# EasyEDA Pro project TTMT_ENTIRE_EASYEDA_PROJECT.epro, board PCB5
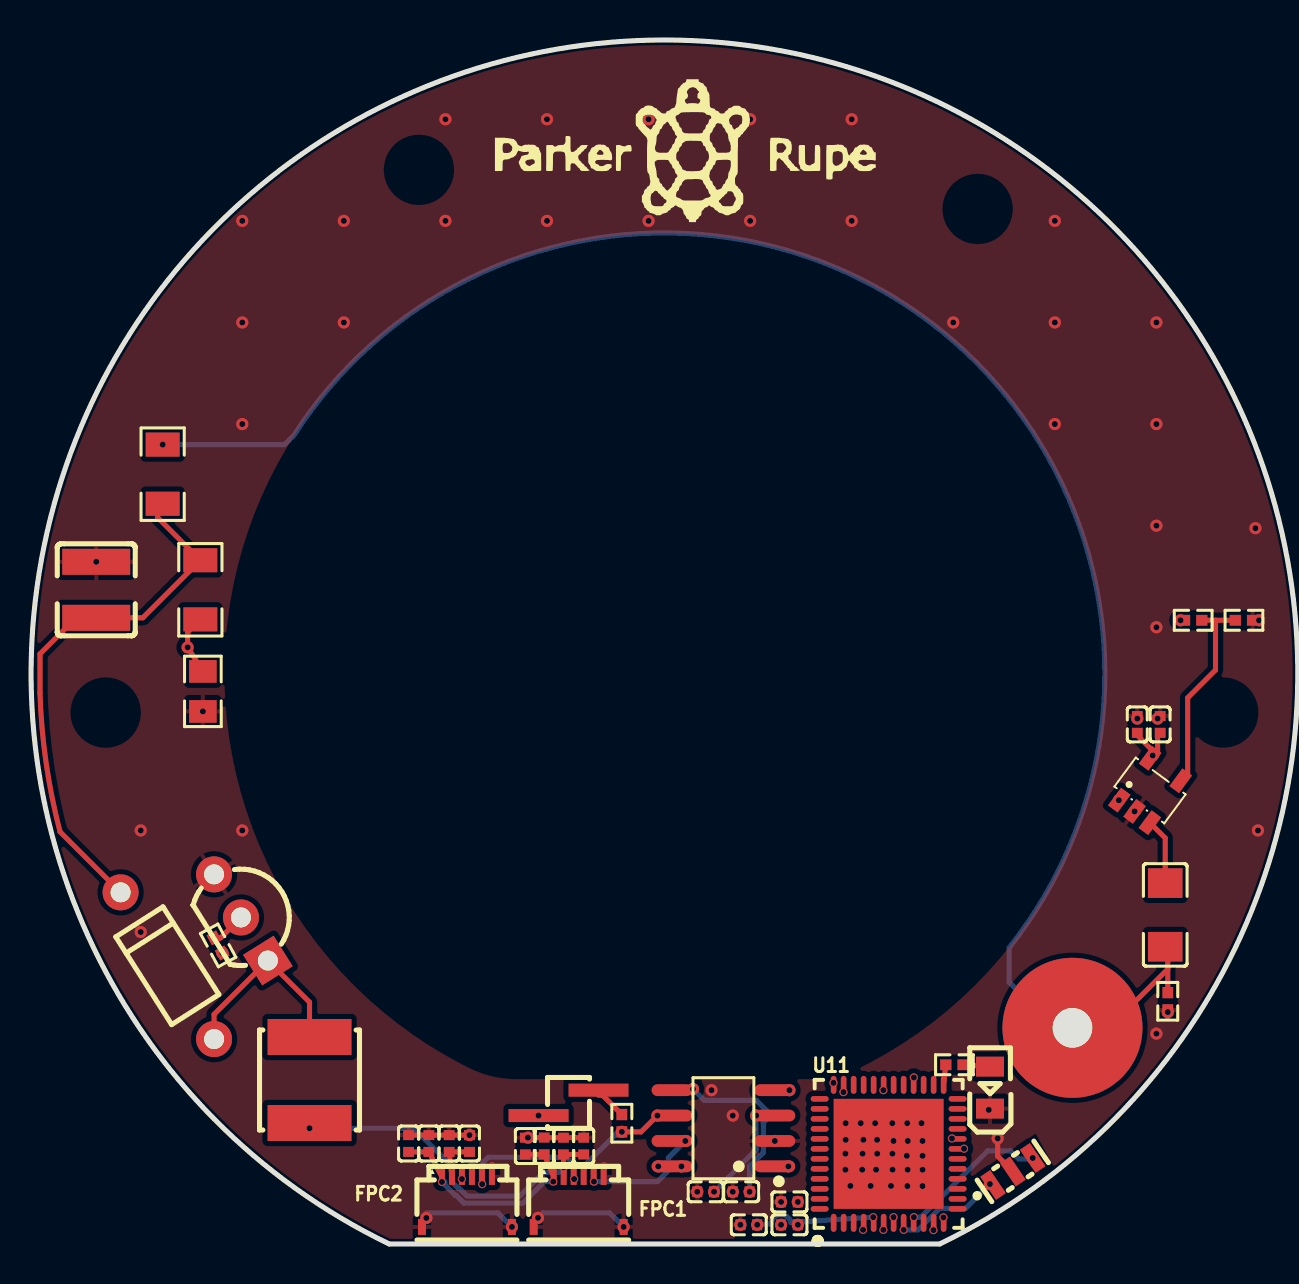
[diagram p16: board, top side]
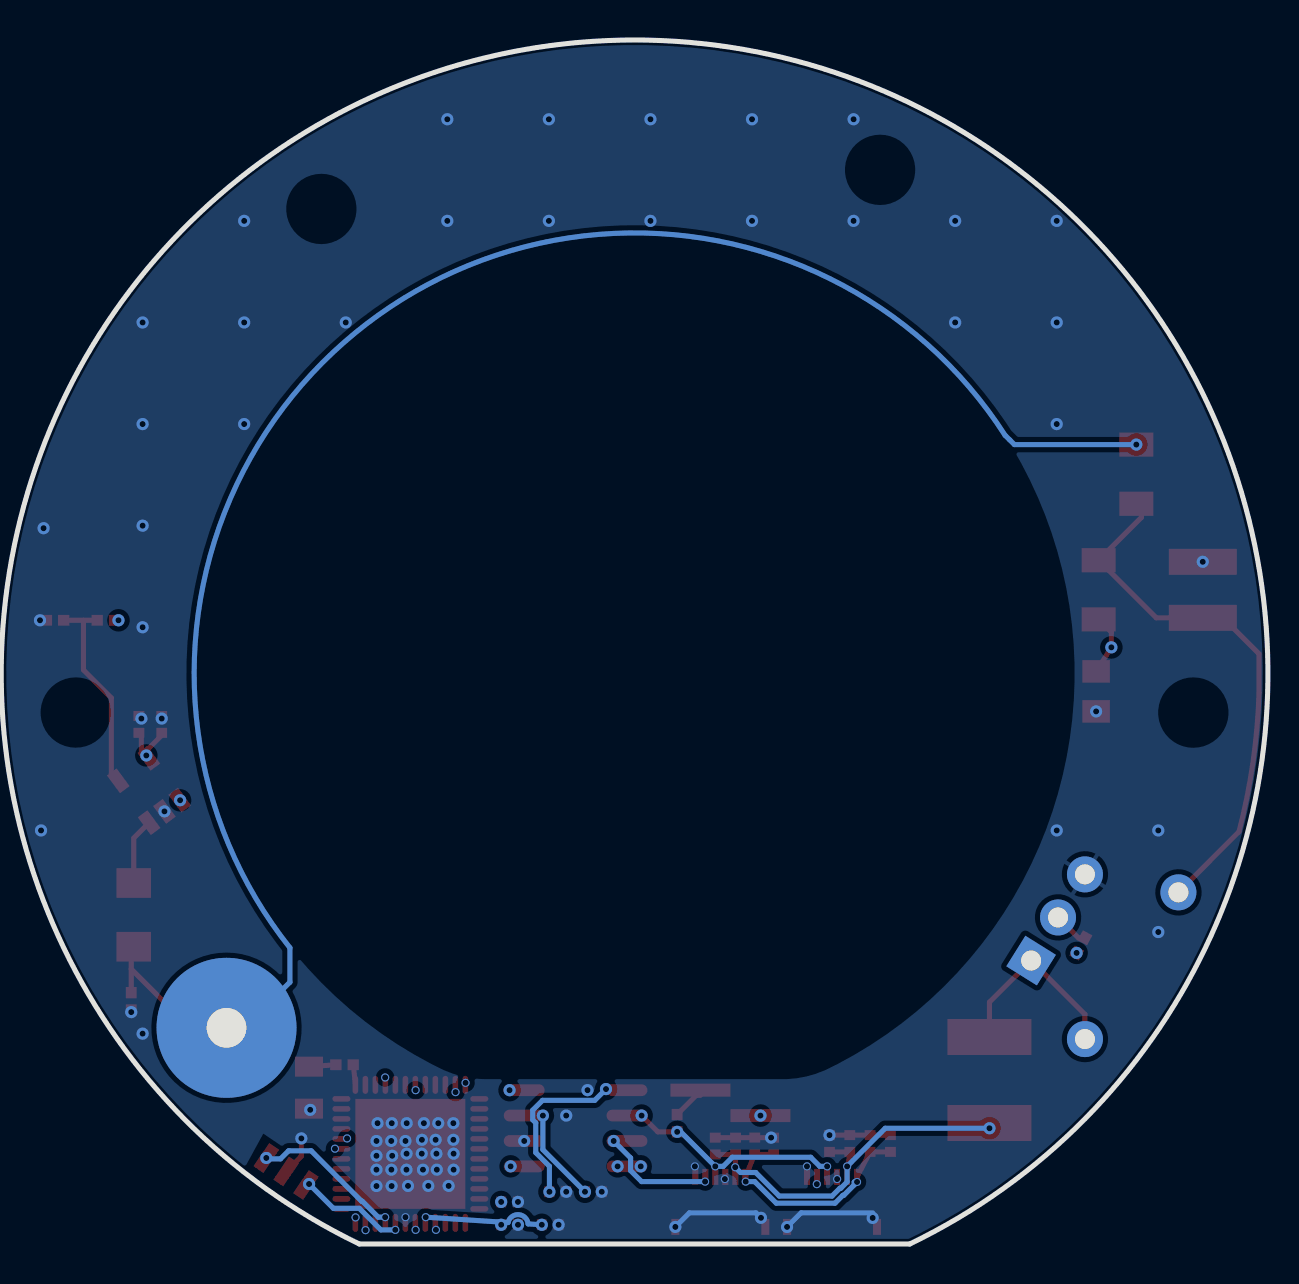
[diagram p17: board, bottom side, seen from below]

Outline 63.35 x 60.2 mm; copper layers: Top Layer, GND, 3V3, Inner3, Inner4, Bottom Layer. Coordinates in mm from the lower left corner of the outline.
Outline path: 17.91,0 45.44,0 arc(31.68,60.2) 17.91,0
Stack: Top Layer 0.035mm Outer layer thickness 1oz / Dielectric1 0.0994mm 3313 RC57% 4.2mil / GND 0.0152mm Inner layer thickness / Dielectric2 0.55mm 0.55mm H/H No copper / 3V3 0.0152mm Inner layer thickness / Dielectric3 0.1088mm 2116 RC54% 4.9mil / Inner3 0.0152mm Inner layer thickness / Dielectric4 0.55mm 0.55mm H/H No copper / Inner4 0.0152mm Inner layer thickness / Dielectric5 0.0994mm 3313 RC57% 4.2mil / Bottom Layer 0.035mm Outer layer thickness 1oz

## Design rules (mm)
template: Custom Config
spacing copperThickness1oz (default): track to track 0.102, other pairs 0 to 0.3
spacing copperThickness2oz: track to track 0.203, other pairs 0 to 0.3
track width copperThickness1oz (default): min 0.127, default 0.254, max 2.54
track width copperThickness2oz: min 0.203, default 0.254, max 2.54
differential pair differentialPair (default): width min 0.127, default 0.254, max 2.54; gap min 0.152, default 0.152
via viaSize (default): diameter min 0.203, default 0.61, max 10; hole min 0.102, default 0.305, max 6.3

## Placement (name value [footprint] x y rotation side)
C1  470pF  [C1111]  3.26 32.71 270 top
C3  100pF  [C1206]  56.72 16.45 90 top
C43  100nF  [C0402]  37.93 0.96 180 top
C44  100nF  [C0402]  37.93 2.1 180 top
C45  100nF  [C0402]  35.9 0.96 180 top
C46  100nF  [C0402]  18.88 5.03 90 top
C47  100nF  [C0402]  21.93 5.03 90 top
C63  10uF  [C0402]  20.91 5.03 270 top
C64  10uF  [C0402]  19.89 5.03 270 top
C65  100nF  [C0402]  24.72 4.9 90 top
C66  10uF  [C0402]  25.66 4.9 270 top
C67  100nF  [C0402]  27.64 4.9 270 top
C68  10uF  [C0402]  26.62 4.9 90 top
C69  100nF  [C0402]  35.51 2.61 180 top
C70  100nF  [C0402]  33.74 2.61 0 top
C71  100nF  [C0402]  55.33 25.98 270 top
C72  10uF  [C0402]  56.47 25.98 270 top
D1  UF4007  [DO-41_BD2.4-L4.7-P8.70-D0.9-RD]  6.81 13.92 302.5 top
FPC1  HC-FPC-05-09-6RLTAG  [FPC-SMD_6P-P0.50_HC-FPC-05-09-6RLTAG]  27.39 2.1 180 top
FPC2  HC-FPC-05-09-6RLTAG  [FPC-SMD_6P-P0.50_HC-FPC-05-09-6RLTAG]  21.8 2.1 180 top
H3  M50-3630242  [HDR-SMD_2P-P1.27_M50-3630242]  26.88 7.06 90 top
L1  1mH  [IND-SMD_L5.0-W5.0_FNR50XXS]  13.92 8.2 90 top
LED4  KT-0805G  [LED0805-R-RD]  47.96 7.82 90 top
Q1  MPSA42  [TO-92-3_L4.8-W3.7-P2.54-R]  10.5 16.33 302 top
R8  1kΩ  [R0402]  46.18 8.96 180 top
R11  560kΩ  [R0402]  58.12 31.19 0 top
R17  10MΩ  [R1206]  8.46 32.71 90 top
R19  120Ω  [R0402]  29.54 6.04 90 top
R20  10kΩ  [R0402]  9.35 14.93 298.4 top
R22  10MΩ  [R1206]  6.58 38.49 90 top
R23  100kΩ  [R0402]  60.66 31.19 0 top
R24  100kΩ  [R0402]  56.85 12.14 90 top
R25  51kΩ  [R0805]  8.59 27.63 90 top
U8  TCAN1042HVDRQ1  [SOIC-8_L4.9-W3.9-P1.27-LS6.0-BL]  34.63 5.79 90 top
U9  TLV3201AIDBVR  [SOT-23-5_L3.0-W1.7-P0.95-LS2.8-BR]  55.96 22.68 233.6 top
U10  SBM-21  [SBM21]  52.08 10.81 0 top
U11  STM32G0B1CEU6  [UFQFPN-48_L7.0-W7.0-P0.50-BL-EP]  42.89 4.51 0 top
X1  8MHz  [OSC-SMD_3P-L3.2-W1.3-P1.20-L]  49.1 3.63 34.2 top

## Footprints (pads in the part's own frame, mm; a bottom-side part is the same pattern mirrored in y, then rotated)
C0402
  rect 0.5x0.54 smd: 1(-0.42,0) 2(0.42,0)
C1111
  rect 1.3x3.4 smd: 1(-1.4,0) 2(1.4,0)
C1206
  rect 1.485x1.728 smd: 1(-1.593,0) 2(1.593,0)
DO-41_BD2.4-L4.7-P8.70-D0.9-RD
  round 1.8 hole 1: 1(-4.35,0) 2(4.35,0)
FPC-SMD_6P-P0.50_HC-FPC-05-09-6RLTAG
  rect 0.3x0.8 smd: 1(1.25,-1.25) 2(0.75,-1.25) 3(0.25,-1.25) 4(-0.25,-1.25) 5(-0.75,-1.25) 6(-1.25,-1.25)
  rect 0.4x0.8 smd: 7(-2.25,1.25) 8(2.25,1.25)
HDR-SMD_2P-P1.27_M50-3630242
  rect 0.65x3 smd: 1(-0.635,1.5) 2(0.635,-1.5)
IND-SMD_L5.0-W5.0_FNR50XXS
  rect 1.8x4.2 smd: 1(-2.15,0) 2(2.15,0)
LED0805-R-RD
  rect 1x1.399 smd: 1(1.05,0) 2(-1.05,0)
OSC-SMD_3P-L3.2-W1.3-P1.20-L
  rect 0.6x1.4 smd: 1(-1.199,0) 2(0,0) 3(1.199,0)
R0402
  rect 0.566x0.54 smd: 1(-0.433,0) 2(0.433,0)
R0805
  rect 1.133x1.377 smd: 1(-1,0) 2(1,0)
R1206
  rect 1.208x1.701 smd: 1(-1.479,0) 2(1.479,0)
SBM21
  round 7 smd far side: 1(0,0)
  round 7 smd: 2(0,0)
SOIC-8_L4.9-W3.9-P1.27-LS6.0-BL
  oval 0.588x2.045 smd: 1(-1.905,-2.57) 2(-0.635,-2.57) 3(0.635,-2.57) 4(1.905,-2.57) 5(1.905,2.57) 6(0.635,2.57) 7(-0.635,2.57) 8(-1.905,2.57)
SOT-23-5_L3.0-W1.7-P0.95-LS2.8-BR
  rect 1.1x0.6 smd: 1(1.3,-0.95) 2(1.3,0) 3(1.3,0.95) 4(-1.3,0.95) 5(-1.3,-0.95)
TO-92-3_L4.8-W3.7-P2.54-R
  rect 1.8x1.8 hole 1: 1(2.54,0)
  round 1.8 hole 1: 2(0,0) 3(-2.54,0)
UFQFPN-48_L7.0-W7.0-P0.50-BL-EP
  oval 0.28x0.9 smd: 1(-2.751,-3.45) 2(-2.251,-3.45) 3(-1.75,-3.45) 4(-1.25,-3.45) 5(-0.749,-3.45) 6(-0.249,-3.45) 7(0.249,-3.45) 8(0.75,-3.45) 9(1.25,-3.45) 10(1.75,-3.45) 11(2.251,-3.45) 12(2.751,-3.45) 25(2.751,3.449) 26(2.251,3.449) 27(1.75,3.449) 28(1.25,3.449) 29(0.75,3.449) 30(0.249,3.449) 31(-0.249,3.449) 32(-0.749,3.449) 33(-1.25,3.449) 34(-1.75,3.449) 35(-2.251,3.449) 36(-2.751,3.449)
  oval 0.9x0.28 smd: 13(3.45,-2.751) 14(3.45,-2.251) 15(3.45,-1.75) 16(3.45,-1.25) 17(3.45,-0.75) 18(3.45,-0.249) 19(3.45,0.249) 20(3.45,0.749) 21(3.45,1.25) 22(3.45,1.75) 23(3.45,2.251) 24(3.45,2.751) 37(-3.449,2.751) 38(-3.449,2.251) 39(-3.449,1.75) 40(-3.449,1.25) 41(-3.449,0.749) 42(-3.449,0.249) 43(-3.449,-0.249) 44(-3.449,-0.75) 45(-3.449,-1.25) 46(-3.449,-1.75) 47(-3.449,-2.251) 48(-3.449,-2.751)
  rect 5.5x5.5 smd: 49(0,0)

## Nets
As in the schematic.

Pads without a net: U11 1 2 3 10 13 14 15 16 17 18 21 22 23 24 26 27 29 30 32 33 34 37 38 39 40 41 42 43 44 47 48

## Via types
v1: diameter 0.406, hole 0.305, Top Layer to Bottom Layer, 26 vias
v2: diameter 0.61, hole 0.305, Top Layer to Bottom Layer, 105 vias

## Routing (per net, layer and track width the routed paths; a pad name or vN(x,y) marks a point on that pad's centre or on a via; arc(x,y) is an arc through that point)
3V3: length 36.3
  Top Layer w0.254: FPC1.1 C66.2 C65.1 ; U9.5 56.34,24.66 56.34,25.43 ; v2(56.1,24.43) 56.1,24.66 55.33,25.43 ; FPC2.1 19.89,4.6 18.88,4.6
  Inner3 w0.254: v1(42.63,0.71) v2(38.35,2.1) ; v2(38.35,0.96) v1(41.61,0.71)
  Bottom Layer w0.254: v1(26.12,3.12) 25.66,3.12 24.59,2.04 21.65,2.04 21.26,2.44 21.21,2.44 20.69,2.96 20.69,3.1 v1(20.55,3.1) ; v2(35.93,2.61) 35.93,3.89 36.62,4.57 36.62,6.06 36.77,6.21 36.77,6.69 36.28,7.18 33.67,7.18 v2(33.1,7.75) ; v1(42.12,1.34) 38,1.07 arc(37.47,1.47) 37,1.01 v2(36.32,0.96)
  vias: v2(57.49,31.19)
+5V: length 36.4
  Top Layer w0.254: FPC2.2 20.91,4.6 21.93,4.6 ; C67.2 C68.1 FPC1.2
  Inner4 w0.254: v2(36.26,6.42) 36.02,6.42 32.26,2.66 27.1,2.66 26.7,3.06 26.7,3.78 v1(26.64,3.84)
  Bottom Layer w0.254: v2(34.16,2.61) 36.26,4.72 v2(36.26,6.42) ; v2(13.92,5.79) 19.14,5.79 v1(21.04,3.88) 21.04,3.1 21.36,2.79 21.4,2.79 21.8,2.4 24.44,2.4 25.62,3.57 26.38,3.57 v1(26.64,3.84)
+400V: length 26.9
  Top Layer w0.254: D1.1 1.45,20.61 arc(0.75,24.05) 0.44,27.55 0.44,29.5 2.25,31.31 5.58,31.31 R17.2 6.33,36.33 6.33,37.02
GND: length 17.1
  Top Layer w0.254: C46.2 C64.1 C63.1 v2(21.93,5.44) ; C67.1 C68.2 v2(24.85,5.32) ; X1.2 48.34,4.39 v2(48.34,5.28)
  Bottom Layer w0.254: v2(29.64,0.85) 28.93,1.56 25.6,1.56 v2(25.35,1.31) ; v2(24.05,0.85) 23.35,1.56 19.77,1.56
  vias: v1(21.54,3.25) v1(23.05,3.88) v1(27.16,3.25) v1(28.66,3.88) v1(43.13,1.34) v2(3.26,34.11) v2(5.48,20.68) v2(5.48,15.6) v2(8.59,26.63) v2(10.56,51.16) v2(10.56,46.08) v2(10.56,41) v2(10.56,20.68) v2(15.64,51.16) v2(15.64,46.08) v2(19.77,1.3) v2(20.72,56.24) v2(20.72,51.16) v2(25.8,56.24) v2(25.8,51.16) v2(30.88,56.24) v2(30.88,51.16) v2(33.32,2.61) v2(34.03,7.69) v2(35.09,6.42) v2(35.09,2.61) v2(35.47,0.96) v2(35.96,56.24) v2(35.96,51.16) v2(37.19,5.15) v2(37.51,2.1) v2(37.51,0.96) v2(40.74,6.04) v2(40.74,5.21) v2(40.73,4.52) v2(40.73,3.72) v2(40.97,2.91) v2(41.04,56.24) v2(41.04,51.16) v2(41.49,6.04) v2(41.59,4.52) v2(41.57,3.72) v2(41.63,5.21) v2(41.99,2.91) v2(42.21,6.04) v2(42.26,3.72) v2(42.31,5.21) v2(42.32,4.52) v2(43.01,2.91) v2(43.07,6.04) v2(43.08,4.52) v2(43.09,3.72) v2(43.13,5.15) v2(43.8,4.41) v2(43.82,6.04) v2(43.85,5.15) v2(43.84,3.72) v2(43.82,2.9) v2(44.53,6.04) v2(44.59,5.15) v2(44.59,4.41) v2(44.59,3.72) v2(44.59,2.9) v2(46.12,46.08) v2(47.9,6.71) v2(51.2,51.16) v2(51.2,46.08) v2(51.2,41) v2(55.19,21.63) v2(55.33,26.27) v2(56.28,46.08) v2(56.28,41) v2(56.28,35.92) v2(56.28,30.84) v2(56.28,10.52) v2(56.34,26.27) v2(56.85,11.6) v2(61.23,35.79) v2(61.36,20.68) v2(61.41,31.19)
BOOT0:
  vias: v1(40.13,8.06)
CANFD_RX: length 9.8
  Inner4 w0.254: v2(37.93,7.69) 39.71,7.69 40.47,6.93 45.55,6.93 46.06,6.42 v1(46.06,5.28)
CANFD_TX: length 12
  Inner4 w0.254: v2(37.88,3.88) 39.91,1.85 45.67,1.85 45.85,2.03 45.85,3.96 v1(46.66,4.77)
CANH: length 15.5
  Inner4 w0.254: 24.21,5.33 24.21,5.53 25.1,6.42 v2(25.38,6.42) 26.75,4.79 27.2,4.34 27.83,4.34 28.15,4.02 v1(28.15,3.12) ; 24.21,5.33 24.21,4.92 23.84,4.56 23.46,4.09 arc(23.4,3.59) 22.93,3.44 v1(22.56,2.99) ; 24.21,5.33 arc(24.21,5.32) 24.21,5.3
  Bottom Layer w0.254: v1(28.15,3.12) 31.32,3.12 31.87,3.67 31.87,4.31 v2(32.72,5.15)
CANL: length 10.7
  Top Layer w0.254: v2(31.32,6.42) 30.51,5.61 v2(29.54,5.61)
  Bottom Layer w0.254: v1(22.04,3.88) 22.41,3.88 22.86,4.34 26.79,4.34 27.24,3.88 v1(27.64,3.88) 29.42,5.66 29.54,5.66
GEIGER_OUT: length 25.6
  Inner3 w0.254: v1(45.13,0.69) 45.13,8.73 44.86,9.01 44.86,9.43 52.04,16.61 52.04,19.82 v2(54.41,22.19)
HV_MONITOR: length 73.2
  Top Layer w0.254: 7.83,29.84 7.83,30.6 R17.1 ; v2(7.83,29.83) R25.2
  Inner4 w0.127: v2(7.83,29.83) 7.78,29.79 3.89,29.79 0.84,26.74 0.84,23.31 arc(0.83,23.27) 0.82,23.22 arc(6.64,9.72) 17.98,0.37 arc(18.18,0.36) 18.37,0.36 38.94,0.36 39.76,1.18 41.73,1.18 41.96,0.95 42.28,0.95 42.51,1.18 42.74,1.18 42.97,0.95 43.3,0.95 43.53,1.18 43.76,1.18 43.99,0.95 44.31,0.95 44.69,1.33 v1(45.63,1.33)
HV_PWM: length 38.2
  Inner3 w0.254: v2(9.57,14.56) 10.32,13.8 10.32,13.77 16.95,7.14 40.82,7.14 42,8.33 v1(44.15,8.33)
OSC_IN: length 5.3
  Bottom Layer w0.254: v1(43.64,0.71) 44.36,0.71 45.44,1.78 46.74,1.78 v2(47.96,3)
OSC_OUT: length 7.4
  Bottom Layer w0.254: 50,4.26 49.38,4.26 48.98,4.66 47.85,4.66 45.33,2.14 45.29,2.14 44.5,1.34 v1(44.15,1.34)
  vias: v2(50.09,4.3)
STB: length 11.7
  Inner3 w0.254: v2(32.53,3.88) 32.65,4.01 35.26,4.01 38.03,6.78 40.97,6.78 41.87,7.69 v1(42.63,7.69)
  vias: v2(31.37,3.88)
SWD_IO:
  vias: v1(40.63,7.59)
$1N2732: length 1.6
  Top Layer w0.254: 28.38,7.44 28.58,7.44 R19.2
$1N2784: length 9.7
  Top Layer w0.254: D1.2 9.15,11.48 Q1.1 13.92,12.09 L1.2
$1N3117: length 3.3
  Top Layer w0.254: C3.2 56.72,20.3 U9.3
$1N3842: length 1.8
  Top Layer w0.254: Q1.2 9.47,15.31 9.14,15.31
$1N4040: length 10.1
  Top Layer w0.254: R11.2 59.24,31.19 ; 59.24,31.19 59.91,31.19 ; 59.24,31.19 59.24,28.7 57.84,27.31 57.84,23.51 U9.4
$1N4044: length 9.9
  Top Layer w0.254: C3.1 56.85,14.74 56.85,13.75 ; 51.18,9.91 51.55,9.53 52.63,9.53 56.85,13.75 ; 56.85,13.75 R24.2
$1N4167: length 85.3
  Bottom Layer w0.254: v2(6.58,39.97) 12.68,39.97 12.91,40.2 arc(13.02,40.32) 13.14,40.43 arc(44.5,46.44) 48.91,14.81 48.91,13.09 50.85,11.15 arc(51.18,9.91) 52.43,9.58
$1N9534: length 1.3
  Top Layer w0.254: R8.1 LED4.1
$1N11861: length 1
  Top Layer w0.254: R8.2 45.63,7.97

## Copper pours and planes (outline as drawn; the poured copper is in the pictures)
3V3 on 3V3: 0.26,59.95 63.1,59.95 63.1,0.26 0.26,0.26
GND on Top Layer: 45.44,0 31.68,60.2 17.91,0
GND on Bottom Layer: 45.44,0 31.68,60.2 17.91,0
GND on GND: 0.26,59.95 63.09,59.95 63.09,0.26 0.26,0.26

Small or netless copper shapes (teardrops, artwork), in the pictures only: 4 on GND
